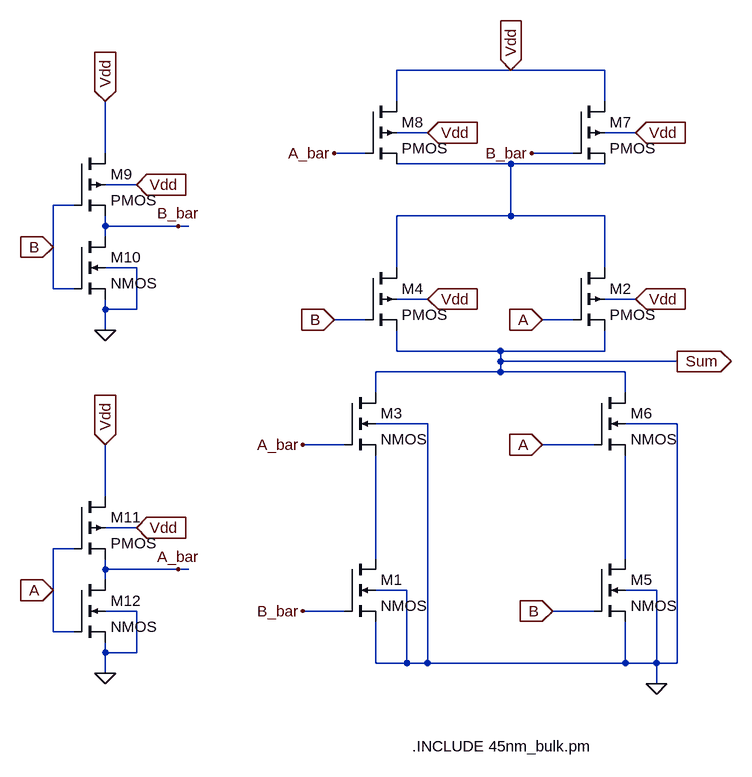
[diagram p0: schematic xor_post_comp_sum.asc]
xor_post_comp_sum.asc, the LTspice schematic file:
Version 4
SHEET 1 880 864
WIRE 288 -192 112 -192
WIRE 432 -192 288 -192
WIRE 112 -144 112 -192
WIRE 432 -144 432 -192
WIRE 160 -96 112 -96
WIRE 480 -96 432 -96
WIRE -336 -64 -336 -144
WIRE 64 -64 16 -64
WIRE 384 -64 320 -64
WIRE 288 -48 112 -48
WIRE 432 -48 288 -48
WIRE -288 -16 -336 -16
WIRE -384 16 -416 16
WIRE 288 32 288 -48
WIRE 288 32 112 32
WIRE 432 32 288 32
WIRE -336 48 -336 32
WIRE -224 48 -336 48
WIRE -208 48 -224 48
WIRE -336 64 -336 48
WIRE -416 80 -416 16
WIRE -288 112 -336 112
WIRE 112 112 112 32
WIRE 432 112 432 32
WIRE -416 144 -416 80
WIRE -384 144 -416 144
WIRE 160 160 112 160
WIRE 480 160 432 160
WIRE -336 176 -336 160
WIRE -288 176 -288 112
WIRE -288 176 -336 176
WIRE 64 192 16 192
WIRE 384 192 336 192
WIRE -336 208 -336 176
WIRE 112 240 112 208
WIRE 272 240 112 240
WIRE 432 240 432 208
WIRE 432 240 272 240
WIRE 272 256 272 240
WIRE 544 256 272 256
WIRE 272 272 272 256
WIRE 272 272 80 272
WIRE 464 272 272 272
WIRE 80 304 80 272
WIRE 464 304 464 272
WIRE 160 352 80 352
WIRE 544 352 464 352
WIRE 32 384 -32 384
WIRE 416 384 336 384
WIRE -336 464 -336 384
WIRE -288 512 -336 512
WIRE -384 544 -416 544
WIRE 80 560 80 400
WIRE 464 560 464 400
WIRE -336 576 -336 560
WIRE -224 576 -336 576
WIRE -208 576 -224 576
WIRE -336 592 -336 576
WIRE -416 608 -416 544
WIRE 128 608 80 608
WIRE 512 608 464 608
WIRE -288 640 -336 640
WIRE 32 640 -32 640
WIRE 416 640 352 640
WIRE -416 672 -416 608
WIRE -384 672 -416 672
WIRE -336 704 -336 688
WIRE -288 704 -288 640
WIRE -288 704 -336 704
WIRE 80 720 80 656
WIRE 128 720 128 608
WIRE 128 720 80 720
WIRE 160 720 160 352
WIRE 160 720 128 720
WIRE 464 720 464 656
WIRE 464 720 160 720
WIRE 512 720 512 608
WIRE 512 720 464 720
WIRE 544 720 544 352
WIRE 544 720 512 720
WIRE -336 736 -336 704
WIRE 512 752 512 720
FLAG 336 192 A
IOPIN 336 192 In
FLAG 480 160 Vdd
IOPIN 480 160 In
FLAG 16 192 B
IOPIN 16 192 In
FLAG 160 160 Vdd
IOPIN 160 160 In
FLAG 352 640 B
IOPIN 352 640 In
FLAG 336 384 A
IOPIN 336 384 In
FLAG 512 752 0
FLAG 480 -96 Vdd
IOPIN 480 -96 In
FLAG 160 -96 Vdd
IOPIN 160 -96 In
FLAG 320 -64 B_bar
FLAG -32 640 B_bar
FLAG 16 -64 A_bar
FLAG -32 384 A_bar
FLAG 288 -192 Vdd
IOPIN 288 -192 In
FLAG 544 256 Sum
IOPIN 544 256 Out
FLAG -336 -144 Vdd
IOPIN -336 -144 In
FLAG -288 -16 Vdd
IOPIN -288 -16 In
FLAG -336 208 0
FLAG -336 384 Vdd
IOPIN -336 384 In
FLAG -288 512 Vdd
IOPIN -288 512 In
FLAG -336 736 0
FLAG -416 80 B
IOPIN -416 80 In
FLAG -416 608 A
IOPIN -416 608 In
FLAG -224 48 B_bar
FLAG -224 576 A_bar
SYMBOL nmos4 32 560 R0
SYMATTR InstName M1
SYMATTR Value2 l=45n w=90n
SYMBOL pmos4 384 112 R0
SYMATTR InstName M2
SYMATTR Value2 l=45n w=180n
SYMBOL nmos4 32 304 R0
SYMATTR InstName M3
SYMATTR Value2 l=45n w=90n
SYMBOL pmos4 64 112 R0
SYMATTR InstName M4
SYMATTR Value2 l=45n w=180n
SYMBOL nmos4 416 560 R0
SYMATTR InstName M5
SYMATTR Value2 l=45n w=90n
SYMBOL nmos4 416 304 R0
SYMATTR InstName M6
SYMATTR Value2 l=45n w=90n
SYMBOL pmos4 384 -144 R0
SYMATTR InstName M7
SYMATTR Value2 l=45n w=180n
SYMBOL pmos4 64 -144 R0
SYMATTR InstName M8
SYMATTR Value2 l=45n w=180n
SYMBOL pmos4 -384 -64 R0
SYMATTR InstName M9
SYMATTR Value2 l=45n w=90n
SYMBOL nmos4 -384 64 R0
SYMATTR InstName M10
SYMATTR Value2 l=45n w=45n
SYMBOL pmos4 -384 464 R0
SYMATTR InstName M11
SYMATTR Value2 l=45n w=90n
SYMBOL nmos4 -384 592 R0
SYMATTR InstName M12
SYMATTR Value2 l=45n w=45n
TEXT 136 848 Left 2 !.INCLUDE 45nm_bulk.pm

The netlist it stands for:
* xor_post_comp_sum.asc
M1 N002 B_bar 0 0 NMOS l=45n w=90n
M2 N001 A Sum Vdd PMOS l=45n w=180n
M3 Sum A_bar N002 0 NMOS l=45n w=90n
M4 N001 B Sum Vdd PMOS l=45n w=180n
M5 N003 B 0 0 NMOS l=45n w=90n
M6 Sum A N003 0 NMOS l=45n w=90n
M7 Vdd B_bar N001 Vdd PMOS l=45n w=180n
M8 Vdd A_bar N001 Vdd PMOS l=45n w=180n
M9 Vdd B B_bar Vdd PMOS l=45n w=90n
M10 B_bar B 0 0 NMOS l=45n w=45n
M11 Vdd A A_bar Vdd PMOS l=45n w=90n
M12 A_bar A 0 0 NMOS l=45n w=45n
.model NMOS NMOS
.model PMOS PMOS
.lib standard.mos
.INCLUDE 45nm_bulk.pm
.backanno
.end